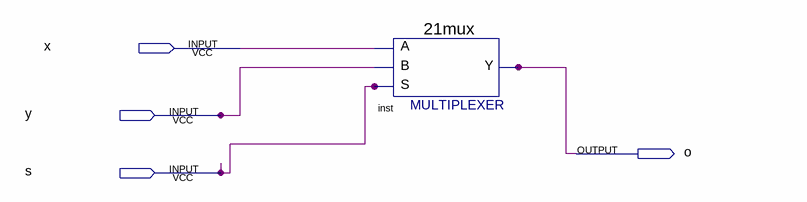
[diagram p0: schematic sheet]
// Quartus schematic HW3SchematicDesign.bdf as structural Verilog: 1 symbols, 4 pins
module HW3SchematicDesign (
  input  x,
  input  y,
  input  s,
  output o
);

  \21mux  inst (.S(s), .B(y), .A(x), .Y(o));
endmodule
